# EAGLE schematic ecu_sch (EAGLE 8.1.0)
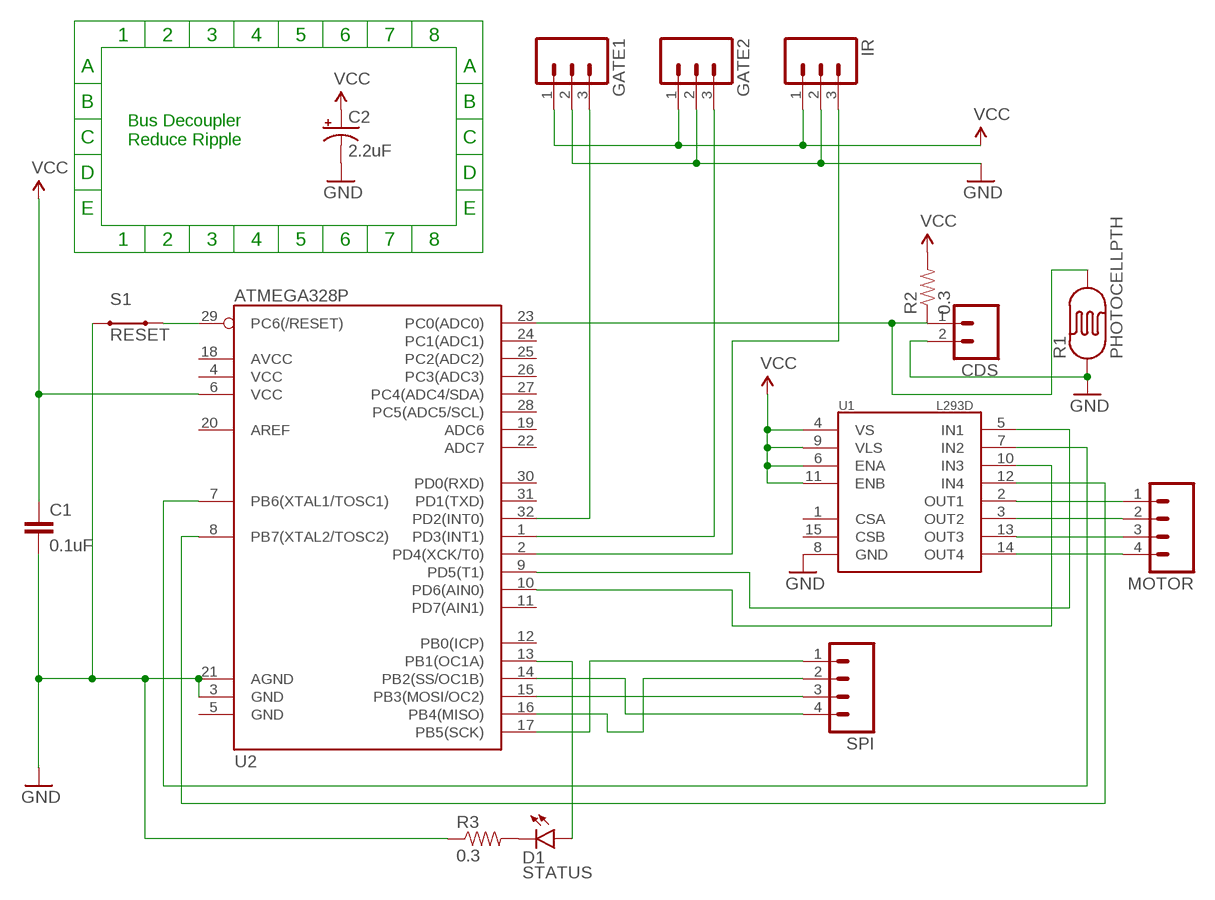
[diagram p0: schematic, sheet 1]

## Parts
C1  0.1uF  0.1UF-25V(+80/-20%)(0603)  [0603-CAP]
C2  2.2uF  47UF-10V-10%(TANT)  [EIA3528]
CDS  M02JST-PTH-2  [JST-2-PTH]
D1  STATUS  LED-WHITE  [LED-1206]
GATE1  M03JST-PTH  [JST-3-PTH]
GATE2  M03JST-PTH  [JST-3-PTH]
IR  M03JST-PTH  [JST-3-PTH]
MOTOR  M04JST-PTH  [JST-4-PTH]
R1  PHOTOCELLPTH  [PHOTOCELL]
R2  0.3  0.3OHM-1/8W-1%(0805)  [0805]
R3  0.3  0.3OHM-1/8W-1%(0805)  [0805]
S1  RESET  SWITCH-MOMENTARY-2-CLOSED  [TACTILE-PTH-12MM]
SPI  M04JST-PTH  [JST-4-PTH]
U1  L293D  L298  [MULTIWATT15]
U2  ATMEGA328P  ATMEGA328_SMT  [TQFP32-08]

## Nets
GND: C1.2 C2.C(-) CDS.2 GATE1.2 GATE2.2 IR.2 R1.1 R3.1 S1.1 U1.8(GND) U2.3(GND) U2.21(AGND)
N$1: U1.5(IN1) U2.9(PD5(T1))
N$2: U1.10(IN3) U2.10(PD6(AIN0))
N$3: U1.7(IN2) U2.7(PB6(XTAL1/TOSC1))
N$4: U1.12(IN4) U2.8(PB7(XTAL2/TOSC2))
N$5: MOTOR.1 U1.2(OUT1)
N$6: MOTOR.2 U1.3(OUT2)
N$7: MOTOR.3 U1.13(OUT3)
N$8: MOTOR.4 U1.14(OUT4)
N$9: SPI.4 U2.14(PB2(SS/OC1B))
N$10: SPI.3 U2.15(PB3(MOSI/OC2))
N$11: SPI.2 U2.16(PB4(MISO))
N$12: SPI.1 U2.17(PB5(SCK))
N$13: GATE1.3 U2.32(PD2(INT0))
N$14: GATE2.3 U2.1(PD3(INT1))
N$15: IR.3 U2.2(PD4(XCK/T0))
N$16: CDS.1 R1.2 R2.1 U2.23(PC0(ADC0))
N$17: S1.3 U2.29(PC6(/RESET))
N$18: D1.C R3.2
N$19: D1.A U2.13(PB1(OC1A))
VCC: C1.1 C2.A(+) GATE1.1 GATE2.1 IR.1 R2.2 U1.4(VS) U1.6(ENA) U1.9(VLS) U1.11(ENB) U2.6(VCC)
Unconnected: U1.1(CSA) U1.15(CSB) U2.4(VCC) U2.5(GND) U2.11(PD7(AIN1)) U2.12(PB0(ICP)) U2.18(AVCC) U2.19(ADC6) U2.20(AREF) U2.22(ADC7) U2.24(PC1(ADC1)) U2.25(PC2(ADC2)) U2.26(PC3(ADC3)) U2.27(PC4(ADC4/SDA)) U2.28(PC5(ADC5/SCL)) U2.30(PD0(RXD)) U2.31(PD1(TXD))

## Notes on the sheet
- Bus Decoupler
  Reduce Ripple

## Library data of the parts
C1 = SparkFun-Capacitors:0.1UF-25V(+80/-20%)(0603): CAP-00810 Ceramic Standard decoupling cap; PROD_ID: CAP-00810
C2 = SparkFun-Capacitors:47UF-10V-10%(TANT): CAP-08310 47uF Tantalum SMT 10V 10% (EIA-3528); PROD_ID: CAP-08310; VALUE: 47uF
CDS = SparkFun-Connectors:M02: Standard 2-pin 0.1" header. Use with - straight break away headers ( PRT-00116) - right angle break away headers (PRT-00553) - swiss pins (PRT-00743) - machine pins (PRT-00117) - female headers (PRT-00115) Molex polarized connector foot print use with: PRT-08233 with associated crimp pins and housings. 2.54_SCREWTERM for use with PRT-10571. 3.5mm Screw Terminal footprints for PRT-08084 5mm Screw Terminal footprints for use with PRT-08433; SKU: PRT-09914
D1 = SparkFun-LED:LED-WHITE: White SMD LEDs LilyPad 1206- DIO-09955; PROD_ID: DIO-09955; VALUE: WHITE
GATE1 GATE2 IR = SparkFun-Connectors:M03: Header 3 Standard 3-pin 0.1" header. Use with straight break away headers (SKU : PRT-00116), right angle break away headers (PRT-00553), swiss pins (PRT-00743), machine pins (PRT-00117), and female headers (PRT-00115). Molex polarized connector foot print use with SKU : PRT-08232 with associated crimp pins and housings.; SKU: PRT-09915
MOTOR SPI = SparkFun-Connectors:M04: Header 4 Standard 4-pin 0.1" header. Use with straight break away headers (SKU : PRT-00116), right angle break away headers (PRT-00553), swiss pins (PRT-00743), machine pins (PRT-00117), and female headers (PRT-00115). Molex polarized connector foot print use with SKU : PRT-08231 with associated crimp pins and housings. 1MM SMD Version SKU: PRT-10208; SKU: PRT-09916
R1 = SparkFun-Sensors:PHOTOCELL: CdS photoresistor. This is a low cost way to detect light levels. Resistance decreases with more incoming light. SparkFun SKU: SEN-09088
R2 R3 = SparkFun-Resistors:0.3OHM-1/8W-1%(0805): RES-11622; PROD_ID: RES-11622
S1 = SparkFun-Electromechanical:SWITCH-MOMENTARY-2-CLOSED: Closed Switch for tutorial schematics. Not intended for PCB design. Maps to 12mm tact switch, only because eagle won't place a part with no package defined. The ordinary SWITCH-MOMENTARY-2 is likely to be more useful for regular schematics.
U1 = SparkFun-PowerIC:L298: L298 Dual Full Bridge Driver
U2 = SparkFun-DigitalIC:ATMEGA328_SMT: 32-Pin Atmega328 part Commonly used on Arduino compatible boards Available in QFP and QFN packages TQFP is IC-09069 QFN is non-stock; PROD_ID: IC-09069